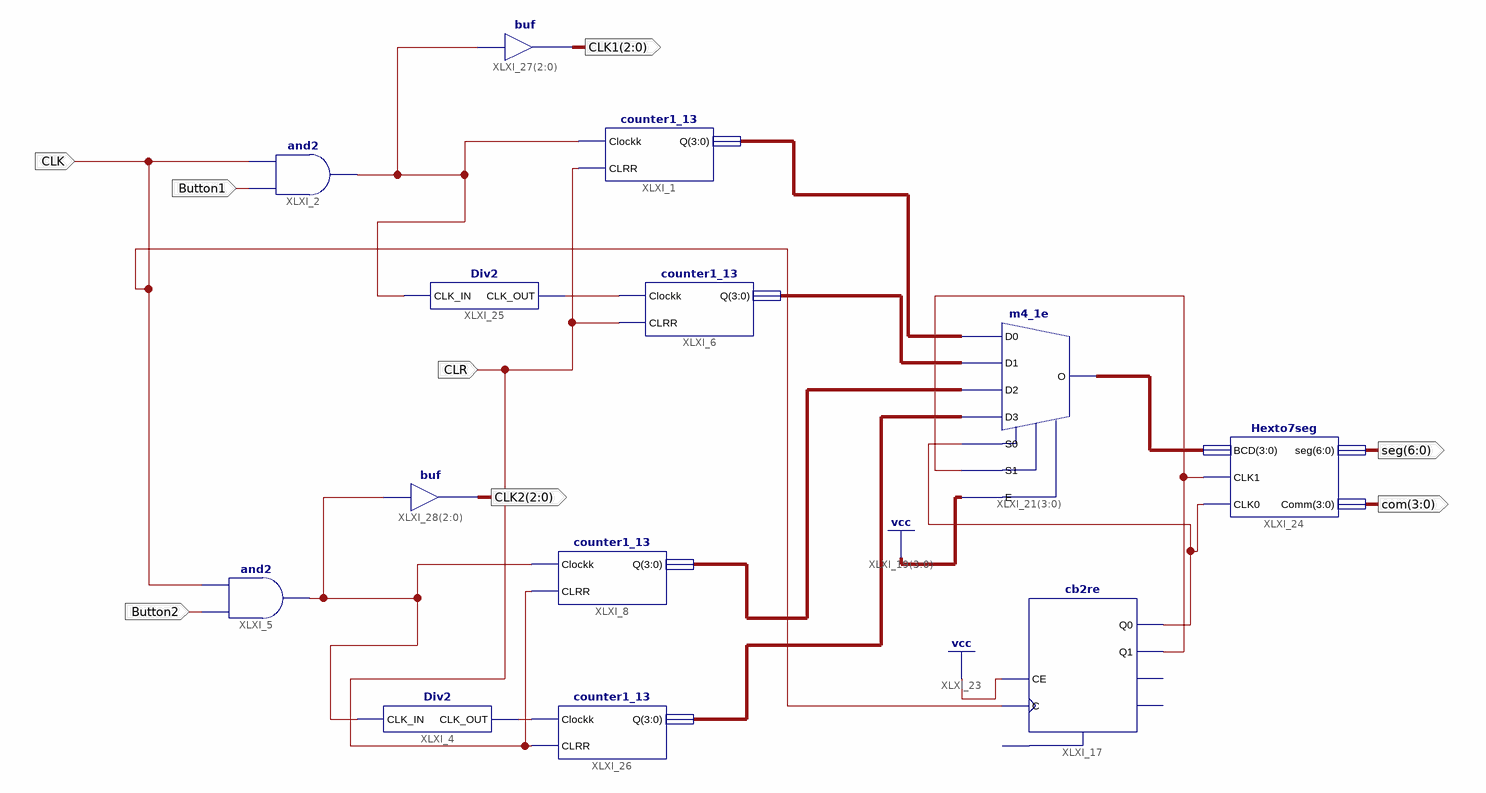
[diagram p0: schematic sheet 1]
// Xilinx ISE schematic random4digit.sch (spartan6) as structural Verilog: 13 symbols, 8 ports
module random4digit (
  input  Button1,
  input  CLK,
  input  Button2,
  input  CLR,
  output [6:0] seg,
  output [3:0] com,
  output [2:0] CLK1,
  output [2:0] CLK2
);

  wire andckl1, andclk2, XLXN_5, XLXN_46, XLXN_47, XLXN_60;
  wire [3:0] Q0, Q1, Q2, Q3, XLXN_45;

  counter1_13 XLXI_1 (.Clockk(andckl1), .CLRR(CLR), .Q(Q0));
  and XLXI_2 (andckl1, Button1, CLK);
  counter1_13 XLXI_8 (.Clockk(andclk2), .CLRR(CLR), .Q(Q2));
  Div2 XLXI_4 (.CLK_IN(andclk2), .CLK_OUT(XLXN_5));
  and XLXI_5 (andclk2, Button2, CLK);
  counter1_13 XLXI_6 (.Clockk(XLXN_60), .CLRR(CLR), .Q(Q1));
  cb2re XLXI_17 (.C(CLK), .CE(1'b1), .Q0(XLXN_46), .Q1(XLXN_47));  // open: R, CEO, TC
  m4_1e XLXI_21[3:0] (.D0(Q0), .D1(Q1), .D2(Q2), .D3(Q3), .E(4'b1111), .S0(XLXN_46), .S1(XLXN_47), .O(XLXN_45));
  Hexto7seg XLXI_24 (.BCD(XLXN_45), .CLK1(XLXN_47), .CLK0(XLXN_46), .seg(seg), .Comm(com));
  Div2 XLXI_25 (.CLK_IN(andckl1), .CLK_OUT(XLXN_60));
  counter1_13 XLXI_26 (.Clockk(XLXN_5), .CLRR(CLR), .Q(Q3));
  assign CLK1 = {3{andckl1}};  // buf XLXI_27[2..0], 3 bits wide
  assign CLK2 = {3{andclk2}};  // buf XLXI_28[2..0], 3 bits wide
endmodule
